# Altium schematic sheet Sheet1.SchDoc
size 594 x 420 mm; Address1: Address1; Address2: Address2; Address3: Address3; Address4: Address4; DocumentNumber: АБВГ.123456.001 Э3; SheetNumber: 1; Scale: 1:1; DocumentType: Схема электрическая принципиальная; FirstReferrence: АБВГ.123456.001
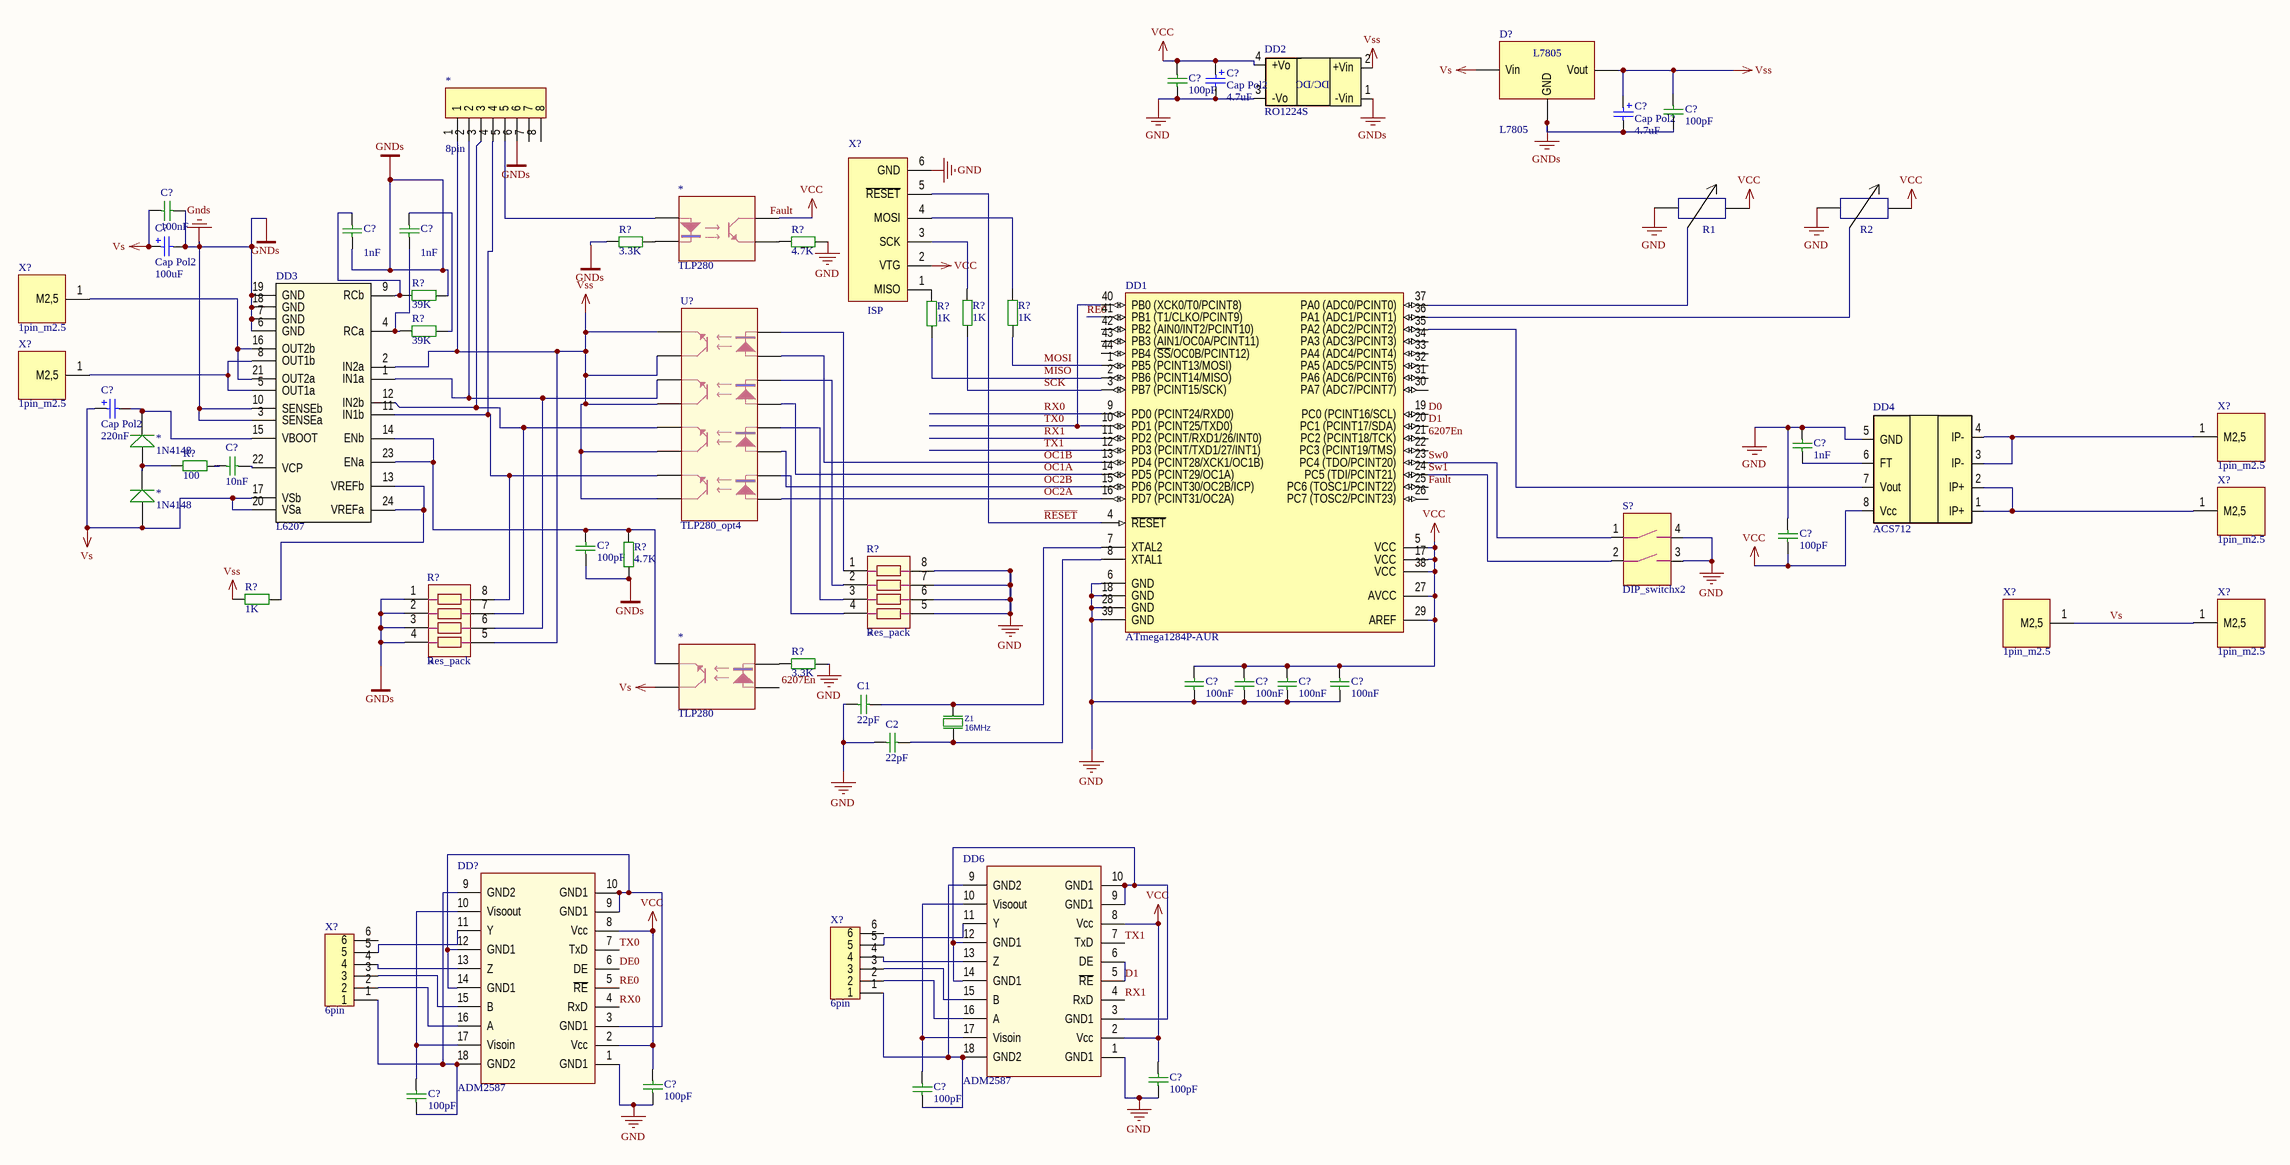
[diagram p0: Sheet1.SchDoc]

## Parts
(Parts that share a designator on the sheet are numbered #1, #2 ... from top to bottom, then left to right.)
*#1  8pin  [10pin]
*#2  TLP280
*#3  1N4148  [DIOMELF2511N]
*#4  1N4148  [DIOMELF2511N]
*#5  TLP280
C1  value 22pF  [0402]  (hidden comment: Cap)
C2  value 22pF  [0402]  (hidden comment: Cap)
C?#1  Cap Pol2  value 4.7uF  [POLAR0.8]
C?#2  value 100pF  [0402]  (hidden comment: Cap)
C?#3  Cap Pol2  value 4.7uF  [POLAR0.8]
C?#4  value 100pF  [0402]  (hidden comment: Cap)
C?#5  value 100nF  [0402]  (hidden comment: Cap)
C?#6  Cap Pol2  value 100uF  [POLAR0.8]
C?#7  value 1nF  [0402]  (hidden comment: Cap)
C?#8  value 1nF  [0402]  (hidden comment: Cap)
C?#9  Cap Pol2  value 220nF  [POLAR0.8]
C?#10  value 10nF  [0402]  (hidden comment: Cap)
C?#11  value 1nF  [0402]  (hidden comment: Cap)
C?#12  value 100pF  [0402]  (hidden comment: Cap)
C?#13  value 100pF  [0402]  (hidden comment: Cap)
C?#14  value 100nF  [0402]  (hidden comment: Cap)
C?#15  value 100nF  [0402]  (hidden comment: Cap)
C?#16  value 100nF  [0402]  (hidden comment: Cap)
C?#17  value 100nF  [0402]  (hidden comment: Cap)
C?#18  value 100pF  [0402]  (hidden comment: Cap)
C?#19  value 100pF  [0402]  (hidden comment: Cap)
C?#20  value 100pF  [0402]  (hidden comment: Cap)
C?#21  value 100pF  [0402]  (hidden comment: Cap)
D?  L7805
DD1  ATmega1284P-AUR  [44A_N]
DD2  RO1224S  [RO1224S]
DD3  L6207  [SO24]
DD4  ACS712  [SOIC8N]
DD6  ADM2587
DD?  ADM2587
R1  Potentiometer  [3314g]  (value not drawn)
R2  Potentiometer  [3314g]  (value not drawn)
R?#1  value 3.3K  [0402]  (hidden comment: Res2)
R?#2  value 4.7K  [0402]  (hidden comment: Res2)
R?#3  value 39K  [0402]  (hidden comment: Res2)
R?#4  value 1K  [0402]  (hidden comment: Res2)
R?#5  value 1K  [0402]  (hidden comment: Res2)
R?#6  value 1K  [0402]  (hidden comment: Res2)
R?#7  value 39K  [0402]  (hidden comment: Res2)
R?#8  value 100  [0402]  (hidden comment: Res2)
R?#9  value 4.7K  [0402]  (hidden comment: Res2)
R?#10  value 1K  [0402]  (hidden comment: Res2)
R?#11  Res_pack
R?#12  Res_pack
R?#13  value 3.3K  [0402]  (hidden comment: Res2)
S?  DIP_switchx2
U?  TLP280_opt4
X?#1  ISP
X?#2  1pin_m2.5
X?#3  1pin_m2.5
X?#4  1pin_m2.5
X?#5  1pin_m2.5
X?#6  1pin_m2.5
X?#7  1pin_m2.5
X?#8  6pin  [6pin]
X?#9  6pin  [6pin]
Z1  value 16MHz  [KX-13]  (hidden comment: XTAL3)

## Nets
GND: C1.1 C2.1 C?#1.2 C?#2.1 C?#11.2 C?#13.2 C?#14.1 C?#15.1 C?#16.1 C?#17.1 C?#18.1 C?#19.1 DD1.6(GND) DD1.18(GND) DD1.28(GND) DD1.39(GND) DD2.3(-Vo) DD4.5(GND) DD6.1(GND1) DD?.1(GND1) R1.1 R2.1 R?#2.2 R?#11.5 R?#11.6 R?#11.7 R?#11.8 R?#13.2 S?.3 S?.4 X?#1.6(GND)
GNDs: *#1.6 C?#3.2 C?#4.1 C?#5.2 C?#6.2 C?#7.1 C?#12.2 D?.2(GND) DD2.1(-Vin) DD3.3(SENSEa) DD3.6(GND) DD3.7(GND) DD3.10(SENSEb) DD3.18(GND) DD3.19(GND) R?#1.1 R?#3.2 R?#9.2 R?#12.1 R?#12.2 R?#12.3 R?#12.4
VCC: *#2.4 C?#1.1 C?#2.2 C?#13.1 C?#14.2 C?#15.2 C?#16.2 C?#17.2 C?#18.2 C?#19.2 DD1.5(VCC) DD1.17(VCC) DD1.27(AVCC) DD1.29(AREF) DD1.38(VCC) DD2.4(+Vo) DD4.8(Vcc) DD6.2(Vcc) DD6.8(Vcc) DD?.2(Vcc) DD?.8(Vcc) R1.2 R2.2 X?#1.2(VTG)
Vs: *#4.1(A) *#5.4 C?#5.1 C?#6.1 C?#9.1 D?.1(Vin) DD3.17(VSb) DD3.20(VSa) X?#6.1(M2,5) X?#7.1(M2,5)
Vss: *#1.1 C?#3.1 C?#4.2 D?.1(Vout) DD2.2(+Vin) DD3.2(IN2a) R?#10.2 R?#12.5 U?.28 U?.29
6207En: DD1.21(PC2_(PCINT18/TCK))
D0: DD1.19(PC0_(PCINT16/SCL))
D1: DD1.20(PC1_(PCINT17/SDA)) DD6.5(~{RE}) DD6.6(DE)
DE0: DD?.6(DE)
Fault: DD1.25(PC6_(TOSC1/PCINT22))
MISO: DD1.2(PB6_(PCINT14/MISO)) R?#4.2
MOSI: DD1.1(PB5_(PCINT13/MOSI)) R?#6.2
OC1A: DD1.14(PD5_(PCINT29/OC1A)) U?.37
OC2A: DD1.16(PD7_(PCINT31/OC2A)) U?.37
OC2B: DD1.15(PD6_(PCINT30/OC2B/ICP)) U?.37
~{RESET}: DD1.4(~{RESET}) X?#1.5(~{RESET})
RE0: DD1.41(PB1_(T1/CLKO/PCINT9)) DD?.5(~{RE})
RX0: DD1.9(PD0_(PCINT24/RXD0)) DD?.4(RxD)
RX1: DD1.11(PD2_(PCINT/RXD1/26/INT0)) DD6.4(RxD)
SCK: DD1.3(PB7_(PCINT15/SCK)) R?#5.2
Sw0: DD1.23(PC4_(TDO/PCINT20)) S?.1
Sw1: DD1.24(PC5_(TDI/PCINT21)) S?.2
TX0: DD1.10(PD1_(PCINT25/TXD0)) DD1.40(PB0_(XCK0/T0/PCINT8)) DD?.7(TxD)
TX1: DD1.12(PD3_(PCINT/TXD1/27/INT1)) DD6.7(TxD)
ОС1B: DD1.13(PD4_(PCINT28/XCK1/OC1B)) U?.37
Net*#1_2: *#1.2 DD3.1(IN1a) R?#12.6 U?.28
Net*#1_3: *#1.3 DD3.12(IN2b) R?#12.7 U?.28
Net*#1_4: *#1.4 DD3.11(IN1b) R?#12.8 U?.28
Net*#1_5: *#1.5 *#2.1
Net*#2_2: *#2.2 R?#1.2
Net*#2_3: *#2.3 R?#2.1
Net*#3_1: *#3.1(A) *#4.2(K) R?#8.1
Net*#3_2: *#3.2(K) C?#9.2 DD3.15(VBOOT)
Net*#5_2: *#5.2 R?#13.1
Net*#5_3: *#5.3 C?#12.1 DD3.14(ENb) DD3.23(ENa) R?#9.1
NetC1_2: C1.2 DD1.7(XTAL2) Z1.3
NetC2_2: C2.2 DD1.8(XTAL1) Z1.1
NetC?#7_2: C?#7.2 DD3.9(RCb) R?#3.1
NetC?#8_1: C?#8.1 DD3.4(RCa) R?#7.1
NetC?#8_2: C?#8.2 R?#7.2
NetC?#10_1: C?#10.1 R?#8.2
NetC?#10_2: C?#10.2 DD3.22(VCP)
NetC?#11_1: C?#11.1 DD4.6(FT)
NetC?#20_1: C?#20.1 DD6.9(GND2) DD6.18(GND2) X?#8.1
NetC?#20_2: C?#20.2 DD6.10(Visoout) DD6.17(Visoin)
NetC?#21_1: C?#21.1 DD?.9(GND2) DD?.18(GND2) X?#9.1
NetC?#21_2: C?#21.2 DD?.10(Visoout) DD?.17(Visoin)
NetDD1_35: DD1.35(PA2_(ADC2/PCINT2)) DD4.7(Vout)
NetDD1_36: DD1.36(PA1_(ADC1/PCINT1)) R2.3
NetDD1_37: DD1.37(PA0_(ADC0/PCINT0)) R1.3
NetDD3_5: DD3.5(OUT1a) DD3.8(OUT1b) X?#3.1(M2,5)
NetDD3_13: DD3.13(VREFb) DD3.24(VREFa) R?#10.1
NetDD3_16: DD3.16(OUT2b) DD3.21(OUT2a) X?#2.1(M2,5)
NetDD4_1: DD4.1(IP+) DD4.2(IP+) X?#5.1(M2,5)
NetDD4_3: DD4.3(IP-) DD4.4(IP-) X?#4.1(M2,5)
NetDD6_3: DD6.3(GND1) DD6.9(GND1) DD6.10(GND1) DD6.12(GND1) DD6.14(GND1)
NetDD6_11: DD6.11(Y) X?#8.5
NetDD6_13: DD6.13(Z) X?#8.4
NetDD6_15: DD6.15(B) X?#8.3
NetDD6_16: DD6.16(A) X?#8.2
NetDD?_3: DD?.3(GND1) DD?.9(GND1) DD?.10(GND1) DD?.12(GND1) DD?.14(GND1)
NetDD?_11: DD?.11(Y) X?#9.5
NetDD?_13: DD?.13(Z) X?#9.4
NetDD?_15: DD?.15(B) X?#9.3
NetDD?_16: DD?.16(A) X?#9.2
NetR?#4_1: R?#4.1 X?#1.1(MISO)
NetR?#5_1: R?#5.1 X?#1.3(SCK)
NetR?#6_1: R?#6.1 X?#1.4(MOSI)
NetR?#11_1: R?#11.1 U?.36
NetR?#11_2: R?#11.2 U?.36
NetR?#11_3: R?#11.3 U?.36
NetR?#11_4: R?#11.4 U?.36

Not connected (* = marked no-connect by the designer): *#1 7 8; *#5 1; DD1 22(PC3_(PCINT19/TMS)) 26(PC7_(TOSC2/PCINT23)) 30(PA7_(ADC7/PCINT7)) 31(PA6_(ADC6/PCINT6)) 32(PA5_(ADC5/PCINT5)) 33(PA4_(ADC4/PCINT4)) 34(PA3_(ADC3/PCINT3)) 42(PB2_(AIN0/INT2/PCINT10)) 43(PB3_(AIN1/OC0A/PCINT11)) 44(PB4_(~{SS}/OC0B/PCINT12)); X?#8 6; X?#9 6

## Notes on the sheet
- Labels drawn without touching a wire or pin: 6207En, Fault
- Перв. примен.
- Справ. №
- Подп. и дата
- Инв. № дубл.
- Взам. инв. №
- Разраб.
- Изм.
- Лист
- № докум.
- Подп.
- Дата
- Лит.
- Масса
- Масштаб
- Пров.
- Т.контр.
- Листов
- Инв. № подл.
- Утв.
- Н.контр.
- 2.106-A2
- Копировал
- Формат А2
- (in symbol RO1224S) DC/DC

## Library data of the parts
*#3 *#4 = Diod
C1 C2 C?#2 C?#4 C?#5 C?#7 C?#8 C?#10-C?#21 = Cap: Capacitor; Published: 8-Jun-2000; LatestRevisionDate: 17-Jul-2002; LatestRevisionNote: Re-released for DXP Platform.; PackageReference: RAD-0.3; Publisher: Altium Limited; PackageDescription: Radial Cap, Thru-Hole; 2 Leads; 0.3 in Pin Spacing
C?#1 C?#3 C?#6 C?#9 = Cap Pol2: Polarized Capacitor (Axial); Published: 8-Jun-2000; LatestRevisionDate: 17-Jul-2002; LatestRevisionNote: Re-released for DXP Platform.; PackageReference: POLAR0.8; Publisher: Altium Limited; PackageDescription: Polarized Capacitor; 2 Leads
D? = L7805: L7805_stab 12->5
DD1 = ATmega1284P-AUR: 8-bit AVR Microcontroller, 128KB Flash, 4KB EEPROM, 16KB SRAM, 44-pin TQFP, Industrial Grade (-40°C to 85°C), Reel; Published: 1-Apr-2010; DatasheetVersion: revA, Jan-2010; PackageVersion: rev.B, Oct-2001; PackageReference: 44A; Publisher: Altium Limited; PackageDescription: 44-Pin Plastic Thin Profile Quad Flat Pack, 10 x 10 x 1.0 mm Body, 0.8 mm Pitch (TQFP); Supplier 1: Digi-Key; Supplier Part Number 1: ATMEGA1284P-AUR-ND; Supplier 2: Mouser; Supplier Part Number 2: 556-ATMEGA1284P-AUR; ComponentLink1Description: Manufacturer Link; ComponentLink1URL: http://www.atmel.com/products/avr/default.asp?; ComponentLink2Description: ATmega164A/164PA/324A/324PA/644A/644PA/1284/1284P Datasheet; ComponentLink2URL: http://www.atmel.com/dyn/resources/prod_documents/doc8272.pdf; ComponentLink3Description: ATmega164A/164PA/324A/324PA/644A/644PA/1284/1284P Summary; ComponentLink3URL: http://www.atmel.com/dyn/resources/prod_documents/8272S.pdf; ComponentLink4Description: Atmel.com Home; ComponentLink4URL: http://www.atmel.com
R?#1-R?#10 R?#13 = Res2: Resistor; Published: 8-Jun-2000; LatestRevisionDate: 17-Jul-2002; LatestRevisionNote: Re-released for DXP Platform.; PackageReference: AXIAL-0.4; Publisher: Altium Limited; PackageDescription: Axial Device, Thru-Hole; 2 Leads; 0.4 in Pin Spacing
S? = Switchx2
Z1 = XTAL3: XTAL
R?#11 R?#12 = Res_pack: Resistance: *